# EAGLE schematic Nebula 1.6 (EAGLE 5.11)

## Sheet 1 of 5
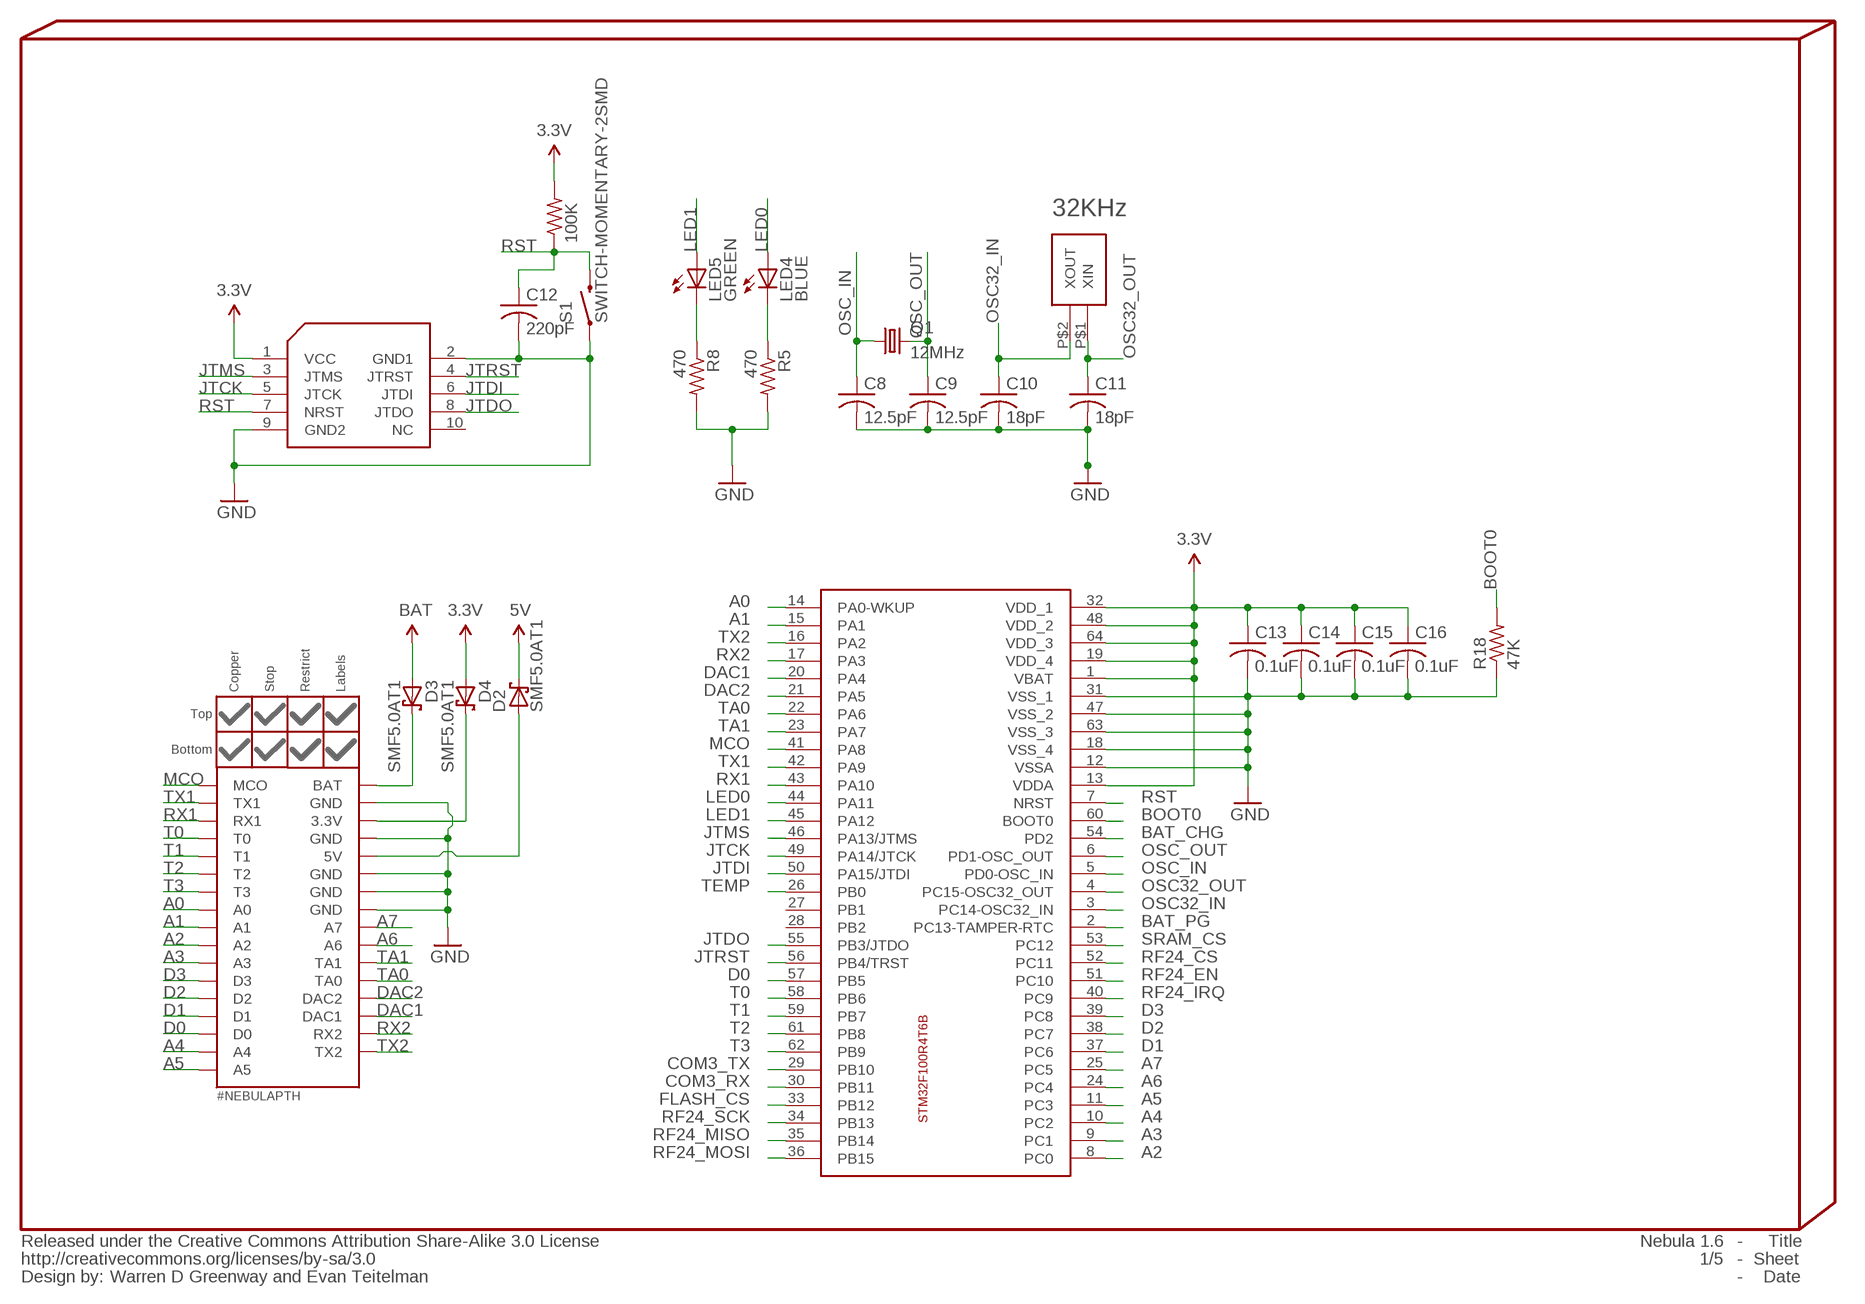
[diagram p0: schematic, sheet 1]

### Parts
C8  12.5pF  C-USC0402  [C0402]
C9  12.5pF  C-USC0402  [C0402]
C10  18pF  C-USC0402  [C0402]
C11  18pF  C-USC0402  [C0402]
C12  220pF  C-USC0402  [C0402]
C13  0.1uF  C-USC0402  [C0402]
C14  0.1uF  C-USC0402  [C0402]
C15  0.1uF  C-USC0402  [C0402]
C16  0.1uF  C-USC0402  [C0402]
D2  SMF5.0AT1  [SOD123FL]
D3  SMF5.0AT1  [SOD123FL]
D4  SMF5.0AT1  [SOD123FL]
INFO3  Warren D Greenway and Evan Teitelman  CC-BY-SA  [CC-BY-SA_]
LED4  BLUE  LED0603  [LED-0603]
LED5  GREEN  LED0603  [LED-0603]
NEBULA1  #NEBULAPTH  [#NEBULA-PTH]
NEBULAPART4  #NEBULA-PARTLABELS-BOTTOM  [#NEBULA-LABELS-BOTT]
Q1  12MHz  CRYSTAL5X3  [CRYSTAL-SMD-5X3]
Q2  CM415  [CM415]
R3  100K  R-US_R0402  [R0402]
R5  470  R-US_R0402  [R0402]
R8  470  R-US_R0402  [R0402]
R18  47K  R-US_R0402  [R0402]
S1  SWITCH-MOMENTARY-2SMD  [TACTILE_SWITCH_SMD]
U3  STM32F100R4T6B  [S-PQFP64-G64]
U$1  STM32-JTAG-10P  [STM32-JTAG-10P]

### Nets
3.3V: C13.1 C14.1 C15.1 C16.1 D4.A R3.2 U3.1(VBAT) U3.13(VDDA) U3.19(VDD_4) U3.32(VDD_1) U3.48(VDD_2) U3.64(VDD_3) U$1.1(VCC) ; supply symbol labelled @3.3V ; also sheet 2,3,5
5V: D2.C ; supply symbol labelled @5V ; also sheet 3,4
A0: NEBULA1.A0 U3.14(PA0-WKUP)
A1: NEBULA1.A1 U3.15(PA1)
A2: NEBULA1.A2 U3.8(PC0)
A3: NEBULA1.A3 U3.9(PC1)
A4: NEBULA1.A4 U3.10(PC2)
A5: NEBULA1.A5 U3.11(PC3)
A6: NEBULA1.A6 U3.24(PC4)
A7: NEBULA1.A7 U3.25(PC5)
BAT: D3.A ; supply symbol labelled @BAT ; also sheet 3
BAT_CHG: U3.54(PD2) ; also sheet 3
BAT_PG: U3.2(PC13-TAMPER-RTC) ; also sheet 3
BOOT0: R18.2 U3.60(BOOT0)
COM3_RX: U3.30(PB11) ; also sheet 4
COM3_TX: U3.29(PB10) ; also sheet 4
D0: NEBULA1.D0 U3.57(PB5)
D1: NEBULA1.D1 U3.37(PC6)
D2: NEBULA1.D2 U3.38(PC7)
D3: NEBULA1.D3 U3.39(PC8)
DAC1: NEBULA1.DAC1 U3.20(PA4)
DAC2: NEBULA1.DAC2 U3.21(PA5)
FLASH_CS: U3.33(PB12) ; also sheet 5
GND: C8.2 C9.2 C10.2 C11.2 C12.2 C13.2 C14.2 C15.2 C16.2 NEBULA1.GND1(GND) NEBULA1.GND2(GND) NEBULA1.GND3(GND) NEBULA1.GND4(GND) NEBULA1.GND5(GND) R5.2 R8.2 R18.1 S1.1 U3.12(VSSA) U3.18(VSS_4) U3.31(VSS_1) U3.47(VSS_2) U3.63(VSS_3) U$1.2(GND1) U$1.9(GND2) ; supply symbol labelled @GND ; also sheet 2,3,4,5
JTCK: U3.49(PA14/JTCK) U$1.5(JTCK)
JTDI: U3.50(PA15/JTDI) U$1.6(JTDI) ; also sheet 5
JTDO: U3.55(PB3/JTDO) U$1.8(JTDO) ; also sheet 5
JTMS: U3.46(PA13/JTMS) U$1.3(JTMS)
JTRST: U3.56(PB4/TRST) U$1.4(JTRST)
LED0: LED4.A U3.44(PA11)
LED1: LED5.A U3.45(PA12)
MCO: NEBULA1.MCO U3.41(PA8)
N$16: D3.C NEBULA1.BAT
N$29: D4.C NEBULA1.3.3V
N$35: LED5.C R8.1
N$37: LED4.C R5.1
N$38: D2.A NEBULA1.5V
OSC32_IN: C10.1 Q2.P$2(XOUT) U3.3(PC14-OSC32_IN)
OSC32_OUT: C11.1 Q2.P$1(XIN) U3.4(PC15-OSC32_OUT)
OSC_IN: C8.1 Q1.1 U3.5(PD0-OSC_IN)
OSC_OUT: C9.1 Q1.3 U3.6(PD1-OSC_OUT)
RF24_CS: U3.52(PC11) ; also sheet 2
RF24_EN: U3.51(PC10) ; also sheet 2
RF24_IRQ: U3.40(PC9) ; also sheet 2
RF24_MISO: U3.35(PB14) ; also sheet 2,5
RF24_MOSI: U3.36(PB15) ; also sheet 2,5
RF24_SCK: U3.34(PB13) ; also sheet 2,5
RST: C12.1 R3.1 S1.3 U3.7(NRST) U$1.7(NRST)
RX1: NEBULA1.COM1_RX(RX1) U3.43(PA10)
RX2: NEBULA1.COM2_RX(RX2) U3.17(PA3)
SRAM_CS: U3.53(PC12) ; also sheet 5
T0: NEBULA1.T0 U3.58(PB6)
T1: NEBULA1.T1 U3.59(PB7)
T2: NEBULA1.T2 U3.61(PB8)
T3: NEBULA1.T3 U3.62(PB9)
TA0: NEBULA1.TA0 U3.22(PA6)
TA1: NEBULA1.TA1 U3.23(PA7)
TEMP: U3.26(PB0) ; also sheet 3
TX1: NEBULA1.COM1_TX(TX1) U3.42(PA9)
TX2: NEBULA1.COM2_TX(TX2) U3.16(PA2)
Unconnected: U3.27(PB1) U3.28(PB2) U$1.10(NC)

## Sheet 2 of 5
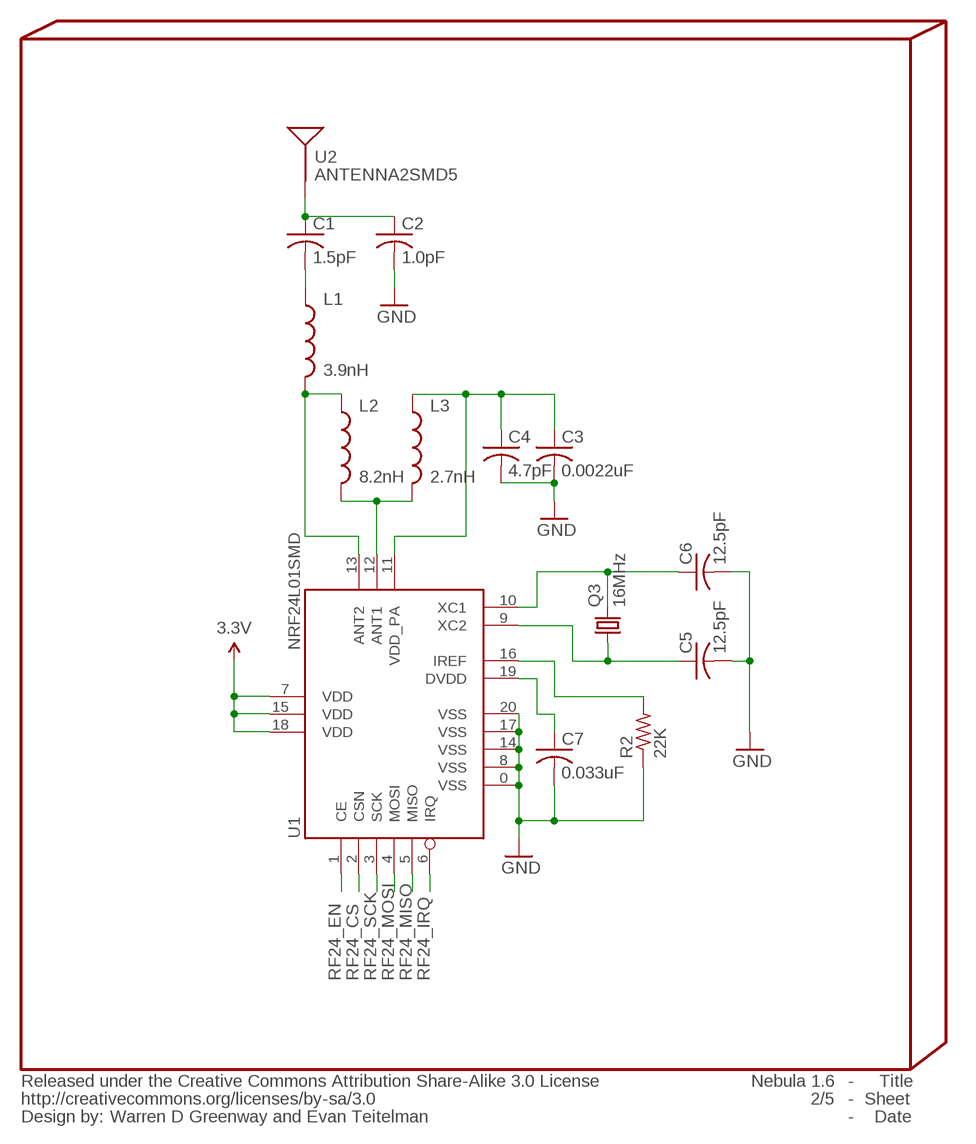
[diagram p1: schematic, sheet 2]

### Parts
C1  1.5pF  C-USC0402  [C0402]
C2  1.0pF  C-USC0402  [C0402]
C3  0.0022uF  C-USC0402  [C0402]
C4  4.7pF  C-USC0402  [C0402]
C5  12.5pF  C-USC0402  [C0402]
C6  12.5pF  C-USC0402  [C0402]
C7  0.033uF  C-USC0402  [C0402]
L1  3.9nH  INDUCTOR0402  [C0402]
L2  8.2nH  INDUCTOR0402  [C0402]
L3  2.7nH  INDUCTOR0402  [C0402]
Q3  16MHz  CRYSTAL5X3  [CRYSTAL-SMD-5X3]
R2  22K  R-US_R0402  [R0402]
U1  NRF24L01SMD  [QFN20]
U2  ANTENNA2SMD5  [ANTENNA-CHIP5]

### Nets
3.3V: U1.7(VDD) U1.15(VDD) U1.18(VDD) ; supply symbol labelled @3.3V ; also sheet 1,3,5
GND: C2.2 C3.2 C4.2 C5.2 C6.2 C7.2 R2.1 U1.0(VSS) U1.8(VSS) U1.14(VSS) U1.17(VSS) U1.20(VSS) ; supply symbol labelled @GND ; also sheet 1,3,4,5
N$1: C1.1 C2.1 U2.FEED(SIGNAL)
N$2: C1.2 L1.1
N$3: L1.2 L2.1 U1.13(ANT2)
N$4: L2.2 L3.2 U1.12(ANT1)
N$5: C3.1 C4.1 L3.1 U1.11(VDD_PA)
N$7: C6.1 Q3.3 U1.10(XC1)
N$8: C5.1 Q3.1 U1.9(XC2)
N$10: R2.2 U1.16(IREF)
N$11: C7.1 U1.19(DVDD)
RF24_CS: U1.2(CSN) ; also sheet 1
RF24_EN: U1.1(CE) ; also sheet 1
RF24_IRQ: U1.6(IRQ) ; also sheet 1
RF24_MISO: U1.5(MISO) ; also sheet 1,5
RF24_MOSI: U1.4(MOSI) ; also sheet 1,5
RF24_SCK: U1.3(SCK) ; also sheet 1,5

## Sheet 3 of 5
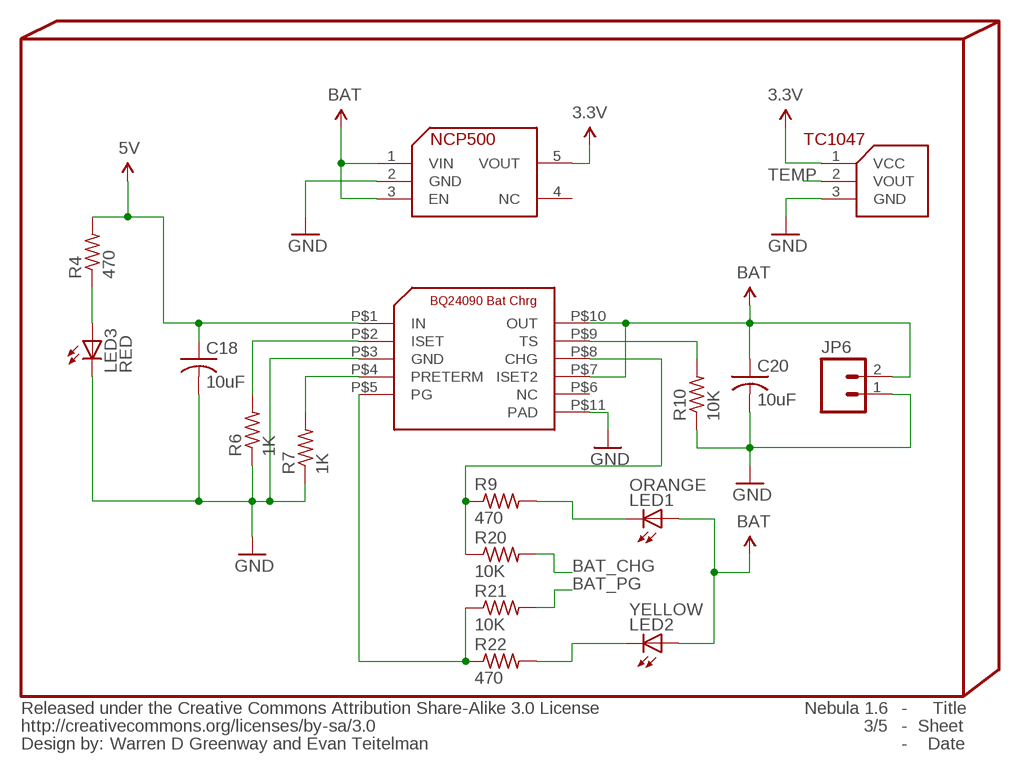
[diagram p2: schematic, sheet 3]

### Parts
C18  10uF  C-USC0805  [C0805]
C20  10uF  C-USC0805  [C0805]
JP6  M02-JST-2MM-SMT  [JST-2-SMD]
LED1  ORANGE  LED0603  [LED-0603]
LED2  YELLOW  LED0603  [LED-0603]
LED3  RED  LED0603  [LED-0603]
R4  470  R-US_R0402  [R0402]
R6  1K  R-US_R0402  [R0402]
R7  1K  R-US_R0402  [R0402]
R9  470  R-US_R0402  [R0402]
R10  10K  R-US_R0402  [R0402]
R20  10K  R-US_R0402  [R0402]
R21  10K  R-US_R0402  [R0402]
R22  470  R-US_R0402  [R0402]
U6  BQ24090  [R-PDSO-G10]
U8  NCP500  [SOT23-5L]
U$3  MICROCHIP-TEMP-TC1047  [SOT23]

### Nets
3.3V: U8.5(VOUT) U$3.1(VCC) ; supply symbol labelled @3.3V ; also sheet 1,2,5
5V: C18.1 R4.2 U6.P$1(IN) ; supply symbol labelled @5V ; also sheet 1,4
BAT: C20.1 JP6.2 LED1.A LED2.A U6.P$7(ISET2) U6.P$10(OUT) U8.1(VIN) U8.3(EN) ; supply symbol labelled @BAT ; also sheet 1
BAT_CHG: R20.2 ; also sheet 1
BAT_PG: R21.2 ; also sheet 1
GND: C18.2 C20.2 JP6.1 LED3.C R6.1 R7.1 R10.1 U6.P$3(GND) U6.P$11(PAD) U8.2(GND) U$3.3(GND) ; supply symbol labelled @GND ; also sheet 1,2,4,5
N$12: R6.2 U6.P$2(ISET)
N$13: R7.2 U6.P$4(PRETERM)
N$14: R21.1 R22.1 U6.P$5(PG)
N$15: LED3.A R4.1
N$17: R9.1 R20.1 U6.P$8(CHG)
N$18: R10.2 U6.P$9(TS)
N$20: LED2.C R22.2
N$23: LED1.C R9.2
TEMP: U$3.2(VOUT) ; also sheet 1
Unconnected: U6.P$6(NC) U8.4(NC)

## Sheet 4 of 5
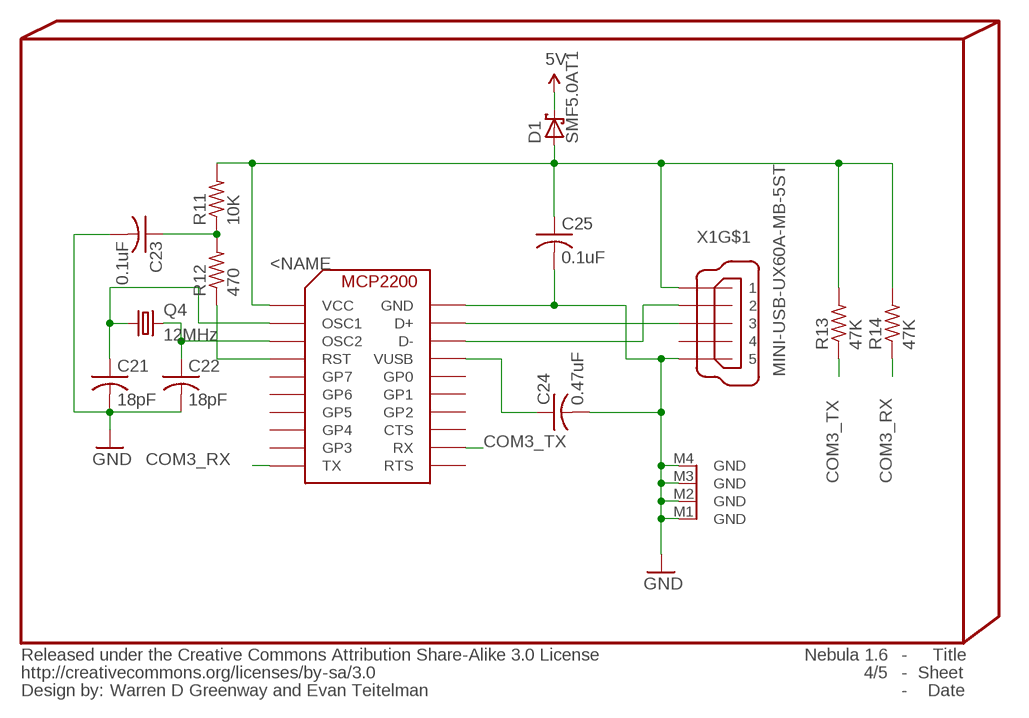
[diagram p3: schematic, sheet 4]

### Parts
C21  18pF  C-USC0402  [C0402]
C22  18pF  C-USC0402  [C0402]
C23  0.1uF  C-USC0402  [C0402]
C24  0.47uF  C-USC0402  [C0402]
C25  0.1uF  C-USC0402  [C0402]
D1  SMF5.0AT1  [SOD123FL]
Q4  12MHz  CRYSTAL5X3  [CRYSTAL-SMD-5X3]
R11  10K  R-US_R0402  [R0402]
R12  470  R-US_R0402  [R0402]
R13  47K  R-US_R0402  [R0402]
R14  47K  R-US_R0402  [R0402]
U7  MICROCHIP-USB-MCP2200  [QFN-20-5X5]
X1  MINI-USB-UX60A-MB-5ST  [UX60A-MB-5ST]

### Nets
5V: D1.C ; supply symbol labelled @5V ; also sheet 1,3
COM3_RX: R14.1 U7.P7(TX) ; also sheet 1
COM3_TX: R13.1 U7.P9(RX) ; also sheet 1
GND: C21.2 C22.2 C23.2 C24.2 C25.2 U7.P17(GND) X1.5 X1.M1(GND) X1.M2(GND) X1.M3(GND) X1.M4(GND) ; supply symbol labelled @GND ; also sheet 1,2,3,5
N$19: C23.1 R11.1 R12.2
N$21: C22.1 Q4.3 U7.P20(OSC2)
N$22: C21.1 Q4.1 U7.P19(OSC1)
N$24: R12.1 U7.P1(RST)
N$26: U7.P15(D-) X1.2
N$28: C24.1 U7.P14(VUSB)
N$34: C25.1 D1.A R11.2 R13.2 R14.2 U7.P18(VCC) X1.1
N$36: U7.P16(D+) X1.3
Unconnected: U7.P2(GP7) U7.P3(GP6) U7.P4(GP5) U7.P5(GP4) U7.P6(GP3) U7.P8(RTS) U7.P10(CTS) U7.P11(GP2) U7.P12(GP1) U7.P13(GP0) X1.4

## Sheet 5 of 5
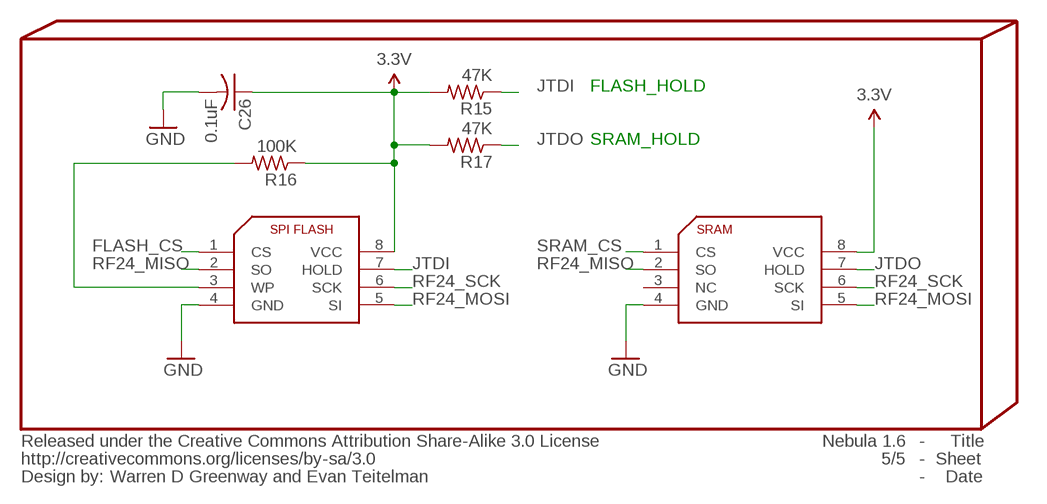
[diagram p4: schematic, sheet 5]

### Parts
C26  0.1uF  C-USC0402  [C0402]
R15  47K  R-US_R0402  [R0402]
R16  100K  R-US_R0402  [R0402]
R17  47K  R-US_R0402  [R0402]
U9  SST25VF080B  [SOIC8]
U10  N25S0830HA  [TSSOP8]

### Nets
3.3V: C26.1 R15.2 R16.1 R17.2 U9.8(VCC) U10.8(VCC) ; supply symbol labelled @3.3V ; also sheet 1,2,3
FLASH_CS: U9.1(CS) ; also sheet 1
GND: C26.2 U9.4(GND) U10.4(GND) ; supply symbol labelled @GND ; also sheet 1,2,3,4
JTDI: R15.1 U9.7(HOLD) ; also sheet 1
JTDO: R17.1 U10.7(HOLD) ; also sheet 1
N$30: R16.2 U9.3(WP)
RF24_MISO: U9.2(SO) U10.2(SO) ; also sheet 1,2
RF24_MOSI: U9.5(SI) U10.5(SI) ; also sheet 1,2
RF24_SCK: U9.6(SCK) U10.6(SCK) ; also sheet 1,2
SRAM_CS: U10.1(CS) ; also sheet 1
Unconnected: U10.3(NC)

### Notes on the sheet
- FLASH_HOLD
- SRAM_HOLD

## Library data of the parts
C1-C16 C18 C20-C26 = rcl:C-US: CAPACITOR, American symbol
D1-D4 = diode:SMF5.0AT1: 200 W Transient Voltage Suppressor Source: Data sheet <http://www.onsemi.com/pub_link/Collateral/SMF5.0AT1-D.PDF>
INFO3 = EagleLbr:CC-BY-SA: Creative Commons Attribution-ShareAlike License <http://creativecommons.org/licenses/by-sa/3.0/>
JP6 = SparkFun:M02: Header 2 Standard 2-pin 0.1" header. Use with straight break away headers (SKU : PRT-00116), right angle break away headers (PRT-00553), swiss pins (PRT-00743), machine pins (PRT-00117), and female headers (PRT-00115). Molex polarized connector foot print use with SKU : PRT-08233 with associated crimp pins and housings.
L1-L3 = SparkFun:INDUCTOR: Inductors Basic Inductor/Choke - 0603 and 1206. Footprints are not proven and vary greatly between part numbers.
LED1-LED5 = SparkFun:LED: LEDs Standard schematic elements and footprints for 5mm, 3mm, 1206, and 0603 sized LEDs. 5mm - Spark Fun Electronics SKU : COM-00529 (and others)
NEBULA1 = PygmyBoards:#NEBULA: Nebula Board and Shield Footprint Pads This is the only absolutely required part for the footprint. The parts in "#NEBULA-PART" are merely aesthetic. A circular board outline should be .001" thick and 1.005" in diameter (Reference circle on the Document (48) layer provided).
NEBULAPART4 = PygmyBoards:#NEBULA-PART: Nebula Board and Shield Footprint Parts These parts are only functional when combined with the pads in "#NEBULA".
Q1 Q3 Q4 = SparkFun:CRYSTAL: Crystals Various standard crystals. Proven footprints. Spark Fun Electronics SKU : COM-00534
Q2 = dublib:CM415
R2-R18 R20-R22 = rcl:R-US_: RESISTOR, American symbol
S1 = SparkFun:SWITCH-MOMENTARY-2
U1 = SparkFun:NRF24L01: 2.4GHz Low Power Transceiver This is the very popular, low cost, very low power RF transceiver from Nordic Semiconductor. Simple SPI interface. SKU: COM-00690
U2 = SparkFun:ANTENNA2: Antenna Single endded antenna. Common with smaller chip antennas. CHIP4 package is the GPS Chip Antenna SKU: GPS-08418. CHIP5 package is 2.4GHz chip antenna SKU: WRL-00144.
U3 = dublib:STM32F100R4T6B
U6 = dublib:BQ24090
U7 = dublib:MICROCHIP-USB-MCP2200
U8 = dublib:NCP500
U9 = dublib:SST25VF080B
U10 = dublib:N25S0830HA
U$1 = Pygmy:STM32-JTAG-10P
U$3 = dublib:MICROCHIP-TEMP-TC1047
X1 = dublib:MINI-USB-: MINI USB Connector Source: http://www.hirose.co.jp/cataloge_hp/e24000019.pdf